# Altium schematic sheet FTDI.SchDoc
size A4; CompanyName: Zohm Control GmbH; Address1: Rittersbacher Straße 48c; Address2: 91126 Schwabach; Address3: GERMANY; DocumentNumber: 4; SheetNumber: 4; SheetTotal: 6; Website: www.zohm-control.com
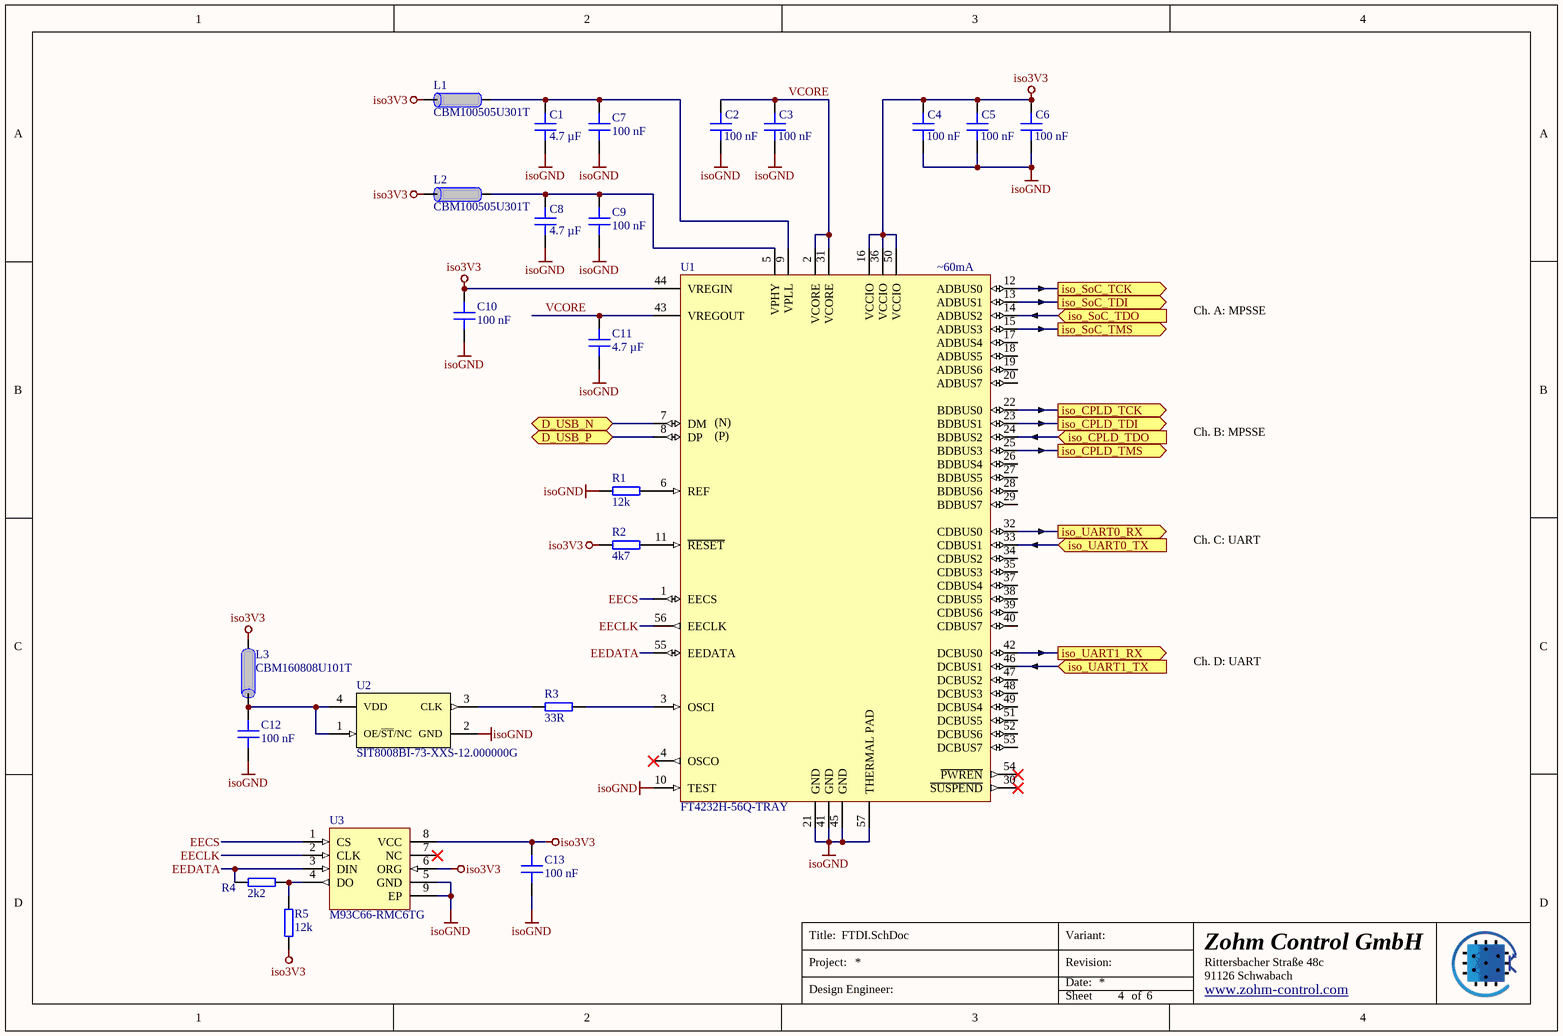
[diagram p0: FTDI.SchDoc]

## Parts
C1  4.7 µF  [C_0402_TE]
C2  100 nF  [C_0402_TE]
C3  100 nF  [C_0402_TE]
C4  100 nF  [C_0402_TE]
C5  100 nF  [C_0402_TE]
C6  100 nF  [C_0402_TE]
C7  100 nF  [C_0402_TE]
C8  4.7 µF  [C_0402_TE]
C9  100 nF  [C_0402_TE]
C10  100 nF  [C_0402_TE]
C11  4.7 µF  [C_0402_TE]
C12  100 nF  [C_0402_TE]
C13  100 nF  [C_0402_TE]
L1  CBM100505U301T  [IND_0402_TE]
L2  CBM100505U301T  [IND_0402_TE]
L3  CBM160808U101T  [IND_0603_TE]
R1  12k  [R_0402_TE]
R2  4k7  [R_0402_TE]
R3  33R  [R_0402_TE]
R4  2k2  [R_0402_TE]
R5  12k  [R_0402_TE]
U1  FT4232H-56Q-TRAY  [QFN50P800X800-57T610X610N]
U2  SIT8008BI-73-XXS-12.000000G  [2016]
U3  M93C66-RMC6TG  [UFDFPN8]

## Ports
D_USB_N (bidir), D_USB_P (bidir), iso_CPLD_TCK (out), iso_CPLD_TDI (out), iso_CPLD_TDO (in), iso_CPLD_TMS (out), iso_SoC_TCK (out), iso_SoC_TDI (out), iso_SoC_TDO (in), iso_SoC_TMS (out), iso_UART0_RX (out), iso_UART0_TX (in), iso_UART1_RX (out), iso_UART1_TX (in)

## Nets
iso3V3: C4.2 C5.2 C6.2 C10.2 C13.2 L1.2 L2.2 L3.1 R2.1 R5.1 U1.16(VCCIO) U1.36(VCCIO) U1.44(VREGIN) U1.50(VCCIO) U3.6(ORG) U3.8(VCC)
isoGND: C1.1 C2.1 C3.1 C4.1 C5.1 C6.1 C7.1 C8.1 C9.1 C10.1 C11.1 C12.1 C13.1 R1.1 U1.10(TEST) U1.21(GND) U1.41(GND) U1.45(GND) U1.57(THERMAL_PAD) U2.2(GND) U3.5(GND) U3.9(EP)
D_USB_N: U1.7(DM) ; port D_USB_N
D_USB_P: U1.8(DP) ; port D_USB_P
EECLK: U1.56(EECLK) U3.2(CLK)
EECS: U1.1(EECS) U3.1(CS)
EEDATA: R4.1 U1.55(EEDATA) U3.3(DIN)
iso_CPLD_TCK: U1.22(BDBUS0) ; port iso_CPLD_TCK
iso_CPLD_TDI: U1.23(BDBUS1) ; port iso_CPLD_TDI
iso_CPLD_TDO: U1.24(BDBUS2) ; port iso_CPLD_TDO
iso_CPLD_TMS: U1.25(BDBUS3) ; port iso_CPLD_TMS
iso_SoC_TCK: U1.12(ADBUS0) ; port iso_SoC_TCK
iso_SoC_TDI: U1.13(ADBUS1) ; port iso_SoC_TDI
iso_SoC_TDO: U1.14(ADBUS2) ; port iso_SoC_TDO
iso_SoC_TMS: U1.15(ADBUS3) ; port iso_SoC_TMS
iso_UART0_RX: U1.32(CDBUS0) ; port iso_UART0_RX
iso_UART0_TX: U1.33(CDBUS1) ; port iso_UART0_TX
iso_UART1_RX: U1.42(DCBUS0) ; port iso_UART1_RX
iso_UART1_TX: U1.46(DCBUS1) ; port iso_UART1_TX
VCORE: C2.2 C3.2 C11.2 U1.2(VCORE) U1.31(VCORE) U1.43(VREGOUT)
NetC1_2: C1.2 C7.2 L1.1 U1.9(VPLL)
NetC8_2: C8.2 C9.2 L2.1 U1.5(VPHY)
NetC12_2: C12.2 L3.2 U2.1(OE/~{ST}/NC) U2.4(VDD)
NetR1_2: R1.2 U1.6(REF)
NetR2_2: R2.2 U1.11(~{RESET})
NetR3_1: R3.1 U2.3(CLK)
NetR3_2: R3.2 U1.3(OSCI)
NetR4_2: R4.2 R5.2 U3.4(DO)

Not connected (* = marked no-connect by the designer): U1 4(OSCO)* 17(ADBUS4) 18(ADBUS5) 19(ADBUS6) 20(ADBUS7) 26(BDBUS4) 27(BDBUS5) 28(BDBUS6) 29(BDBUS7) 30(~{SUSPEND})* 34(CDBUS2) 35(CDBUS3) 37(CDBUS4) 38(CDBUS5) 39(CDBUS6) 40(CDBUS7) 47(DCBUS2) 48(DCBUS3) 49(DCBUS4) 51(DCBUS5) 52(DCBUS6) 53(DCBUS7) 54(~{PWREN})*; U3 7(NC)*

## Notes on the sheet
- (near U1) ~60mA
- Ch. A: MPSSE
- Ch. B: MPSSE
- Ch. C: UART
- Ch. D: UART
- Title:
- Project:
- Date:
- Revision:
- Variant:
- Design Engineer:
- Sheet
- of
- (in symbol FT4232H-56Q-TRAY) (N); (P)

## Library data of the parts
C1 C8 C11 = CL05A475MQ5NRNC: 6.3V 4.7uF X5R ±20% 0402 Multilayer Ceramic Capacitors MLCC - SMD/SMT ROHS; Manufacturer: Samsung Electro-Mechanics; Voltage Rating: 6.3 VDC; Created from: AGeiger; Manufacturer Part Number: CL05A475MQ5NRNC; PartID: 143; Created On: 13.12.2023 21:58:39; ComponentLink1Description: Datasheet; ComponentLink1URL: https://datasheet.lcsc.com/lcsc/1810231822_Samsung-Electro-Mechanics-CL05A475MQ5NRNC_C307423.pdf; Component Type: Capacitor 0402; Device Package: 0402; Last Updated: 13.12.2023 21:58:39; Mounting Type: SMD; Operating Temperature: -55 to +85°C; Series: X5R; Supplier 1: LCSC; Supplier Part Number 1: C307423; Type: Capacitor; Tolerance: 20 %; Value: 4.7 µF; Live Cycle Status: 1; LCSC Part Number: C307423
C2-C7 C9 C10 C12 C13 = GRM155R71H104KE14D: 50V 100nF X7R ±10% 0402 Multilayer Ceramic Capacitors MLCC - SMD/SMT ROHS; Manufacturer: Murata Electronics; Voltage Rating: 50 VDC; Created from: AGeiger; Manufacturer Part Number: GRM155R71H104KE14D; PartID: 144; Created On: 13.12.2023 22:03:54; ComponentLink1Description: Datasheet; ComponentLink1URL: https://datasheet.lcsc.com/lcsc/1809272047_Murata-Electronics-GRM155R71H104KE14D_C77020.pdf; Component Type: Capacitor 0402; Device Package: 0402; Last Updated: 13.12.2023 22:03:54; Mounting Type: SMD; Operating Temperature: -55 to +125°C; Series: X7R; Supplier 1: LCSC; Supplier Part Number 1: C77020; Type: Capacitor; Tolerance: 10 %; Value: 100 nF; Live Cycle Status: 1; LCSC Part Number: C77020
L1 L2 = CBM100505U301T: 300mΩ ±25% 300Ω@100MHz 0402 Ferrite Beads ROHS; Manufacturer: FH (Guangdong Fenghua Advanced Tech); DC current: 0.6 A; Value: 300 mOhm; Created from: AGeiger; Manufacturer Part Number: CBM100505U301T; PartID: 20; Created On: 13.12.2023 22:24:41; ComponentLink1Description: Datasheet; ComponentLink1URL: https://datasheet.lcsc.com/lcsc/2304140030_FH--Guangdong-Fenghua-Advanced-Tech-CBM100505U301T_C394406.pdf; Component Type: Ferrite Beads; Device Package: 0402; Last Updated: 13.12.2023 22:24:41; Mounting Type: SMD; Operating Temperature: -40 to +85°C; Supplier 1: LCSC; Supplier Part Number 1: C394406; Type: Ferrite Bead; Live Cycle Status: 1; LCSC Part Number: C394406
L3 = CBM160808U101T: 60mΩ ±25% 100Ω@100MHz 0603 Ferrite Beads ROHS; Manufacturer: FH (Guangdong Fenghua Advanced Tech); DC current: 2.5 A; Value: 60 mOhm; Created from: AGeiger; Manufacturer Part Number: CBM160808U101T; PartID: 21; Created On: 13.12.2023 22:36:14; ComponentLink1Description: Datasheet; ComponentLink1URL: https://datasheet.lcsc.com/lcsc/1912111437_FH--Guangdong-Fenghua-Advanced-Tech-CBM160808U101T_C361675.pdf; Component Type: Ferrite Beads; Device Package: 0603; Last Updated: 13.12.2023 22:36:14; Mounting Type: SMD; Operating Temperature: -40 to +85°C; Supplier 1: LCSC; Supplier Part Number 1: C361675; Type: Ferrite Bead; Live Cycle Status: 1; LCSC Part Number: C361675
R1 R5 = RC0402FR-0712KL: 62.5mW Thick Film Resistors ±100ppm/℃ ±1% 12kΩ 0402 Chip Resistor - Surface Mount ROHS; Manufacturer: YAGEO; Created from: AGeiger; Manufacturer Part Number: RC0402FR-0712KL; PartID: 307; Created On: 13.12.2023 21:39:32; ComponentLink1Description: Datasheet; ComponentLink1URL: https://datasheet.lcsc.com/lcsc/2304140030_YAGEO-RC0402FR-0712KL_C114760.pdf; Component Type: SMD resistor; Device Package: 0402; Last Updated: 13.12.2023 21:39:32; Mounting Type: SMD; Supplier 1: LCSC; Supplier Part Number 1: C114760; Type: Resistor; Tolerance: 1%; Value: 12k; Live Cycle Status: 1; LCSC Part Number: C114760
R2 = RC0402FR-074K7L: 62.5mW Thick Film Resistors ±100ppm/℃ ±1% 4.7kΩ 0402 Chip Resistor - Surface Mount ROHS; Manufacturer: YAGEO; Created from: AGeiger; Manufacturer Part Number: RC0402FR-074K7L; PartID: 306; Created On: 13.12.2023 21:34:05; ComponentLink1Description: Datasheet; ComponentLink1URL: https://datasheet.lcsc.com/lcsc/2304140030_YAGEO-RC0402FR-074K7L_C105871.pdf; Component Type: SMD resistor; Device Package: 0402; Last Updated: 13.12.2023 21:39:32; Mounting Type: SMD; Supplier 1: LCSC; Supplier Part Number 1: C105871; Type: Resistor; Tolerance: 1%; Value: 4k7; Live Cycle Status: 1; LCSC Part Number: C105871
R3 = RC0402FR-0733RL: 62.5mW Thick Film Resistors ±100ppm/℃ ±1% 33Ω 0402 Chip Resistor - Surface Mount ROHS; Manufacturer: YAGEO; Created from: AGeiger; Manufacturer Part Number: RC0402FR-0733RL; PartID: 308; Created On: 13.12.2023 22:29:11; ComponentLink1Description: Datasheet; ComponentLink1URL: https://datasheet.lcsc.com/lcsc/2304140030_YAGEO-RC0402FR-0733RL_C138002.pdf; Component Type: SMD resistor; Device Package: 0402; Last Updated: 13.12.2023 22:29:11; Mounting Type: SMD; Supplier 1: LCSC; Supplier Part Number 1: C138002; Type: Resistor; Tolerance: 1%; Value: 33R; Live Cycle Status: 1; LCSC Part Number: C138002
R4 = RC0402FR-072K2L: 62.5mW Thick Film Resistors ±100ppm/℃ ±1% 2.2kΩ 0402 Chip Resistor - Surface Mount ROHS; Manufacturer: YAGEO; Created from: AGeiger; Manufacturer Part Number: RC0402FR-072K2L; PartID: 309; Created On: 13.12.2023 22:31:34; ComponentLink1Description: Datasheet; ComponentLink1URL: https://datasheet.lcsc.com/lcsc/2304140030_YAGEO-RC0402FR-072K2L_C114762.pdf; Component Type: SMD resistor; Device Package: 0402; Last Updated: 13.12.2023 22:31:34; Mounting Type: SMD; Supplier 1: LCSC; Supplier Part Number 1: C114762; Type: Resistor; Tolerance: 1%; Value: 2k2; Live Cycle Status: 1; LCSC Part Number: C114762
U1 = FT4232H-56Q-TRAY: USB Interface IC Quad 480Mbs 4 UART USB 2.0 12Mbit; Manufacturer: FTDI; Created from: AGeiger; PartID: 1; Created On: 26.11.2023 16:58:07; ComponentLink1Description: Datasheet; ComponentLink1URL: https://www.mouser.de/datasheet/2/163/DS_FT4232H-1621254.pdf; Component Type: USB Controller; Device Package: VQFN-56; Last Updated: 26.11.2023 16:58:07; Manufacturer Part Number: FT4232H-56Q-TRAY; Mounting Type: SMD; Operating Temperature: -40 to 85 °C; Series: FT4232H; Supplier 1: Mouser; Supplier Part Number 1: 895-FT4232H-56Q-TRAY; Value: FT4232H-56Q-TRAY; LCSC Part Number: C1521561
U2 = SIT8008BI-73-XXS-12.000000G: Clock-Standardoszillatoren -40 to 85C, 2016, 50ppm, 2.25V-3.63V, 12MHz, ST, 250 pcs T&R 8 mm; Manufacturer: SiTime; Created from: AGeiger; Manufacturer Part Number: SIT8008BI-73-XXS-12.000000G; PartID: 2; Created On: 11.01.2024 17:02:48; ComponentLink1Description: Datasheet; ComponentLink1URL: https://www.mouser.de/datasheet/2/371/SiT8008B_datasheet-1291019.pdf; Component Type: Oscillator; Device Package: 2016; Last Updated: 11.01.2024 17:02:48; Mounting Type: SMD; Operating Temperature: -40 to +85 °C; Supplier 1: Mouser; Supplier Part Number 1: 788-8008BI73XXS120G; Value: 12 MHz; LCSC Part Number: C1508636
U3 = M93C66-RMC6TG: 4Kbit MICROWIRE EE 1.8 V to 5.5 V; Manufacturer: STMicroelectronics; Created from: AGeiger; Manufacturer Part Number: M93C66-RMC6TG; PartID: 2; Created On: 19.11.2023 15:06:30; ComponentLink1Description: Datasheet; ComponentLink1URL: https://www.mouser.de/datasheet/2/389/m93c46_w-1849748.pdf; Component Type: EEPROM; Device Package: UFDFPN-8; Last Updated: 19.11.2023 21:39:04; Mounting Type: SMD; Operating Temperature: -40 to +85 °C; Series: M93xxx; Supplier 1: Mouser; Supplier Part Number 1: 511-M93C66-RMC6TG; Supplier 2: LCSC; Supplier Part Number 2: C2061956; Type: Memory; Value: M93C66-RMC6TG; LCSC Part Number: C2061956